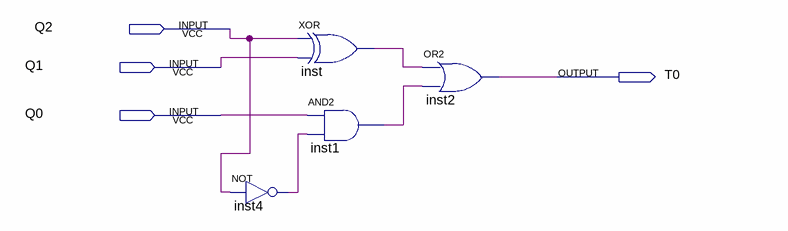
[diagram p0: schematic sheet]
// Quartus schematic T0.bdf as structural Verilog: 4 symbols, 4 pins
module T0 (
  input  Q2,
  input  Q1,
  input  Q0,
  output T0
);

  wire inst1_out, inst4_out, inst_out;

  not inst4 (inst4_out, Q2);
  xor inst (inst_out, Q2, Q1);
  and inst1 (inst1_out, Q0, inst4_out);
  or inst2 (T0, inst_out, inst1_out);
endmodule
